# EAGLE schematic schematic (EAGLE 9.3.1)
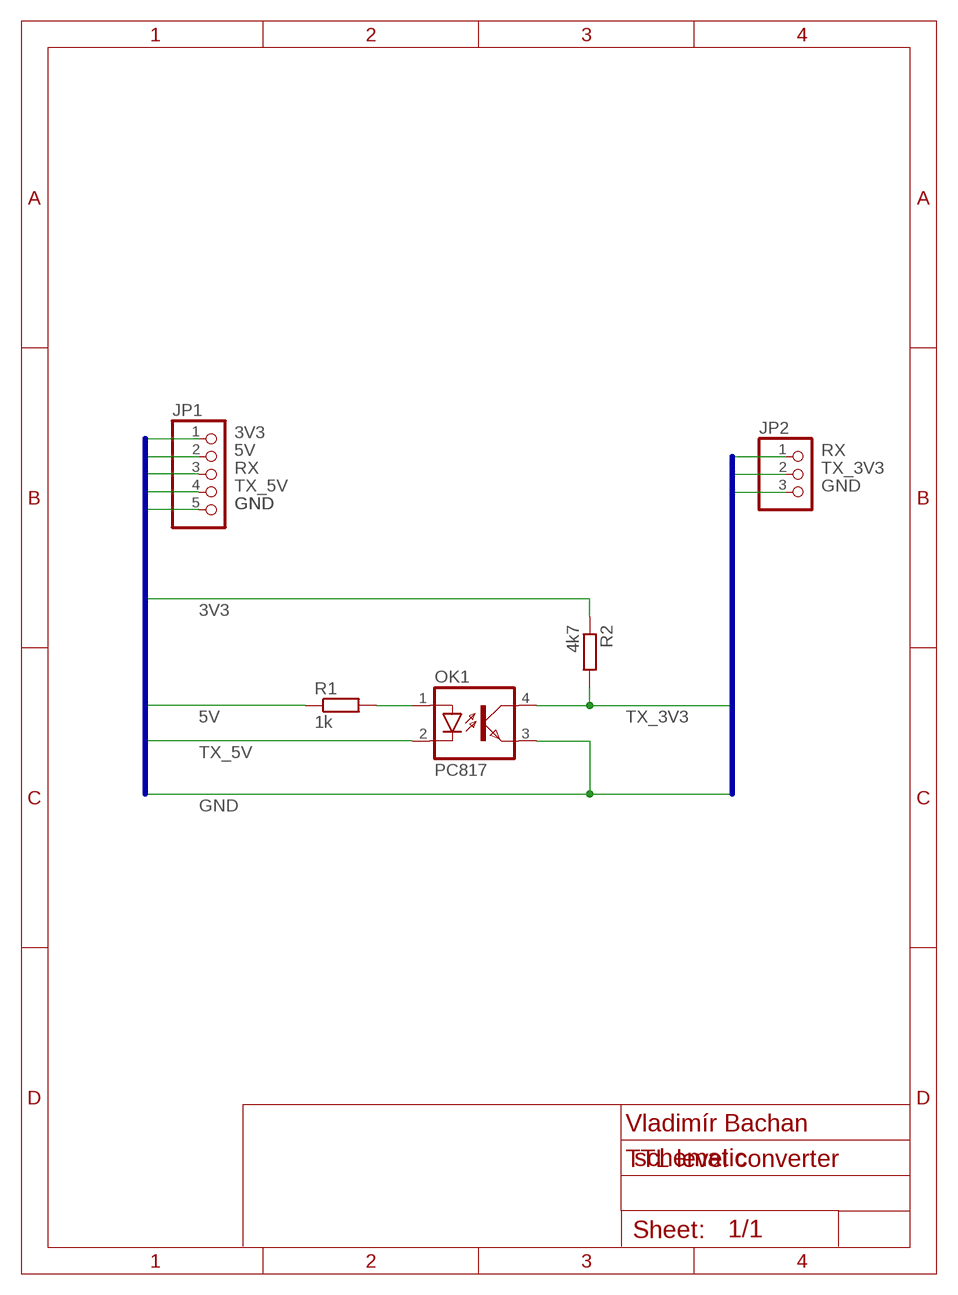
[diagram p0: schematic, sheet 1]

## Parts
JP1  PINHD-1X5  [1X05]
JP2  PINHD-1X3  [1X03]
OK1  PC817  [DIL04]
R1  1k  R-EU_0207/10  [0207/10]
R2  4k7  R-EU_0207/10  [0207/10]

## Nets
3V3: JP1.1 R2.1
5V: JP1.2 R1.1
GND: JP1.5 JP2.3 OK1.3(EMIT)
N$1: OK1.1(A) R1.2
RX: JP1.3 JP2.1
TX_3V3: JP2.2 OK1.4(COL) R2.2
TX_5V: JP1.4 OK1.2(C)

## Buses
GND,RX,TX_3V3
BUS1:3V3,5V,GND,RX,TX_5V

## Notes on the sheet
- Vladimír Bachan
- TTL level converter

## Library data of the parts
JP1 = pinhead:PINHD-1X5: PIN HEADER
JP2 = pinhead:PINHD-1X3: PIN HEADER
OK1 = optocoupler:PC817: SHARP OPTO COUPLER; MPN: PC817X4J000F; OC_FARNELL: 9707727; OC_NEWARK: 97K7059
R1 R2 = rcl:R-EU_: RESISTOR, European symbol; SPICEPREFIX: R